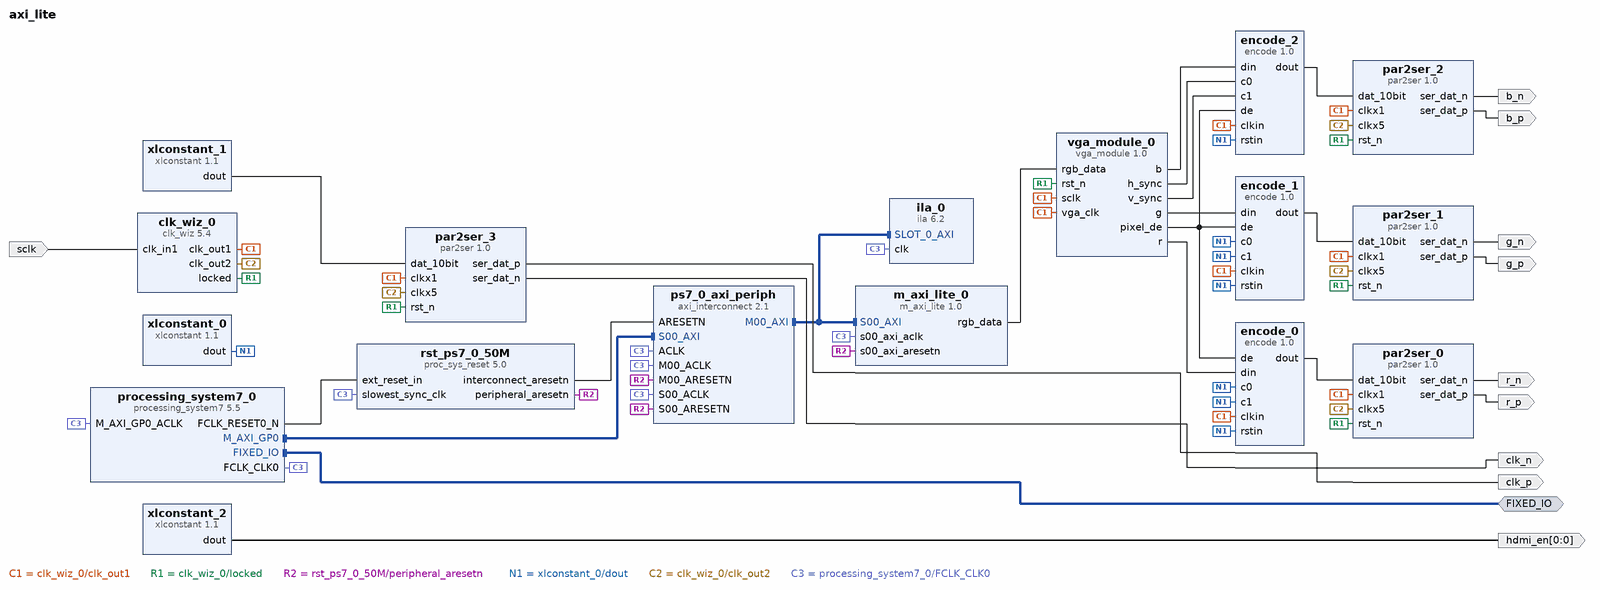
[diagram p0: block diagram of the top level]
# Vivado block design axi_lite, xc7z020clg400-2, Vivado 2017.4
create_bd_design axi_lite

create_bd_intf_port -mode Master -vlnv xilinx.com:display_processing_system7:fixedio_rtl:1.0 FIXED_IO
create_bd_port -dir O r_p
create_bd_port -dir O r_n
create_bd_port -dir O g_p
create_bd_port -dir O g_n
create_bd_port -dir O b_p
create_bd_port -dir O b_n
create_bd_port -dir O clk_p
create_bd_port -dir O clk_n
create_bd_port -dir O -from 0 -to 0 hdmi_en
create_bd_port -dir I -type clk sclk
set_property -dict {CONFIG.FREQ_HZ 50000000} [get_bd_ports sclk]

create_bd_cell -type ip -vlnv xilinx.com:ip:processing_system7:5.5 processing_system7_0
set_property -dict [list \
  CONFIG.PCW_FCLK_CLK0_BUF FALSE \
  CONFIG.PCW_UART_PERIPHERAL_FREQMHZ 100 \
  CONFIG.PCW_UIPARAM_DDR_ENABLE 0 \
  CONFIG.PCW_ENET0_PERIPHERAL_ENABLE 0 \
  CONFIG.PCW_UART0_PERIPHERAL_ENABLE 1 \
  CONFIG.PCW_UART0_UART0_IO {MIO 46 .. 47} \
] [get_bd_cells processing_system7_0]
# 51 more settings of processing_system7_0 are not shown: defaults, MIO pin electricals, DDR timing, and values the tool derives
create_bd_cell -type ip -vlnv xilinx.com:user:vga_module:1.0 vga_module_0
create_bd_cell -type ip -vlnv xilinx.com:user:par2ser:1.0 par2ser_0
create_bd_cell -type ip -vlnv xilinx.com:user:par2ser:1.0 par2ser_1
create_bd_cell -type ip -vlnv xilinx.com:user:par2ser:1.0 par2ser_2
create_bd_cell -type ip -vlnv xilinx.com:user:par2ser:1.0 par2ser_3
create_bd_cell -type ip -vlnv xilinx.com:user:encode:1.0 encode_0
create_bd_cell -type ip -vlnv xilinx.com:user:encode:1.0 encode_1
create_bd_cell -type ip -vlnv xilinx.com:user:encode:1.0 encode_2
create_bd_cell -type ip -vlnv xilinx.com:ip:clk_wiz:5.4 clk_wiz_0
set_property -dict [list \
  CONFIG.PRIM_IN_FREQ 50.000 \
  CONFIG.CLKIN1_JITTER_PS 200.0 \
  CONFIG.CLKOUT2_USED true \
  CONFIG.NUM_OUT_CLKS 2 \
  CONFIG.CLKOUT1_REQUESTED_OUT_FREQ 65.000 \
  CONFIG.CLKOUT2_REQUESTED_OUT_FREQ 325.000 \
  CONFIG.USE_RESET false \
  CONFIG.MMCM_DIVCLK_DIVIDE 1 \
  CONFIG.MMCM_CLKFBOUT_MULT_F 19.500 \
  CONFIG.MMCM_CLKIN1_PERIOD 20.000 \
  CONFIG.MMCM_CLKIN2_PERIOD 10.0 \
  CONFIG.MMCM_CLKOUT0_DIVIDE_F 15.000 \
  CONFIG.MMCM_CLKOUT1_DIVIDE 3 \
  CONFIG.CLKOUT1_JITTER 181.851 \
  CONFIG.CLKOUT1_PHASE_ERROR 160.484 \
  CONFIG.CLKOUT2_JITTER 131.539 \
  CONFIG.CLKOUT2_PHASE_ERROR 160.484 \
] [get_bd_cells clk_wiz_0]
create_bd_cell -type ip -vlnv xilinx.com:ip:xlconstant:1.1 xlconstant_0
set_property -dict {CONFIG.CONST_VAL 0} [get_bd_cells xlconstant_0]
create_bd_cell -type ip -vlnv xilinx.com:ip:xlconstant:1.1 xlconstant_1
set_property -dict {CONFIG.CONST_WIDTH 10 CONFIG.CONST_VAL 992} [get_bd_cells xlconstant_1]
create_bd_cell -type ip -vlnv xilinx.com:ip:axi_interconnect:2.1 ps7_0_axi_periph
set_property -dict {CONFIG.NUM_MI 1} [get_bd_cells ps7_0_axi_periph]
create_bd_cell -type ip -vlnv xilinx.com:ip:proc_sys_reset:5.0 rst_ps7_0_50M
create_bd_cell -type ip -vlnv xilinx.com:ip:xlconstant:1.1 xlconstant_2
create_bd_cell -type ip -vlnv xilinx.com:user:m_axi_lite:1.0 m_axi_lite_0
create_bd_cell -type ip -vlnv xilinx.com:ip:ila:6.2 ila_0

# ---- connections ----

connect_bd_intf_net [get_bd_intf_pins processing_system7_0/M_AXI_GP0] [get_bd_intf_pins ps7_0_axi_periph/S00_AXI]
connect_bd_intf_net [get_bd_intf_pins ps7_0_axi_periph/M00_AXI] [get_bd_intf_pins m_axi_lite_0/S00_AXI]
connect_bd_intf_net [get_bd_intf_pins ps7_0_axi_periph/M00_AXI] [get_bd_intf_pins ila_0/SLOT_0_AXI]
connect_bd_intf_net [get_bd_intf_ports FIXED_IO] [get_bd_intf_pins processing_system7_0/FIXED_IO]
connect_bd_net [get_bd_pins clk_wiz_0/clk_out1] \
  [get_bd_pins vga_module_0/sclk] [get_bd_pins vga_module_0/vga_clk] [get_bd_pins encode_2/clkin] \
  [get_bd_pins encode_1/clkin] [get_bd_pins encode_0/clkin] [get_bd_pins par2ser_3/clkx1] [get_bd_pins par2ser_0/clkx1] \
  [get_bd_pins par2ser_1/clkx1] [get_bd_pins par2ser_2/clkx1]
connect_bd_net [get_bd_pins clk_wiz_0/locked] \
  [get_bd_pins vga_module_0/rst_n] [get_bd_pins par2ser_3/rst_n] [get_bd_pins par2ser_2/rst_n] [get_bd_pins par2ser_1/rst_n] \
  [get_bd_pins par2ser_0/rst_n]
connect_bd_net [get_bd_pins processing_system7_0/FCLK_RESET0_N] [get_bd_pins rst_ps7_0_50M/ext_reset_in]
connect_bd_net [get_bd_pins rst_ps7_0_50M/peripheral_aresetn] \
  [get_bd_pins ps7_0_axi_periph/S00_ARESETN] [get_bd_pins ps7_0_axi_periph/M00_ARESETN] \
  [get_bd_pins m_axi_lite_0/s00_axi_aresetn]
connect_bd_net [get_bd_pins rst_ps7_0_50M/interconnect_aresetn] [get_bd_pins ps7_0_axi_periph/ARESETN]
connect_bd_net [get_bd_pins m_axi_lite_0/rgb_data] [get_bd_pins vga_module_0/rgb_data]
connect_bd_net [get_bd_pins xlconstant_0/dout] \
  [get_bd_pins encode_0/rstin] [get_bd_pins encode_1/rstin] [get_bd_pins encode_2/rstin] [get_bd_pins encode_0/c0] \
  [get_bd_pins encode_0/c1] [get_bd_pins encode_1/c0] [get_bd_pins encode_1/c1]
connect_bd_net [get_bd_pins clk_wiz_0/clk_out2] \
  [get_bd_pins par2ser_0/clkx5] [get_bd_pins par2ser_1/clkx5] [get_bd_pins par2ser_2/clkx5] [get_bd_pins par2ser_3/clkx5]
connect_bd_net [get_bd_pins encode_0/dout] [get_bd_pins par2ser_0/dat_10bit]
connect_bd_net [get_bd_pins encode_1/dout] [get_bd_pins par2ser_1/dat_10bit]
connect_bd_net [get_bd_pins encode_2/dout] [get_bd_pins par2ser_2/dat_10bit]
connect_bd_net [get_bd_pins xlconstant_1/dout] [get_bd_pins par2ser_3/dat_10bit]
connect_bd_net [get_bd_pins vga_module_0/g] [get_bd_pins encode_1/din]
connect_bd_net [get_bd_pins vga_module_0/b] [get_bd_pins encode_2/din]
connect_bd_net [get_bd_pins vga_module_0/h_sync] [get_bd_pins encode_2/c0]
connect_bd_net [get_bd_pins vga_module_0/v_sync] [get_bd_pins encode_2/c1]
connect_bd_net [get_bd_pins vga_module_0/pixel_de] [get_bd_pins encode_2/de] [get_bd_pins encode_0/de] [get_bd_pins encode_1/de]
connect_bd_net [get_bd_pins vga_module_0/r] [get_bd_pins encode_0/din]
connect_bd_net [get_bd_pins par2ser_3/ser_dat_p] [get_bd_ports clk_p]
connect_bd_net [get_bd_pins par2ser_3/ser_dat_n] [get_bd_ports clk_n]
connect_bd_net [get_bd_pins par2ser_2/ser_dat_p] [get_bd_ports b_p]
connect_bd_net [get_bd_pins par2ser_2/ser_dat_n] [get_bd_ports b_n]
connect_bd_net [get_bd_pins par2ser_1/ser_dat_p] [get_bd_ports g_p]
connect_bd_net [get_bd_pins par2ser_1/ser_dat_n] [get_bd_ports g_n]
connect_bd_net [get_bd_pins par2ser_0/ser_dat_p] [get_bd_ports r_p]
connect_bd_net [get_bd_pins par2ser_0/ser_dat_n] [get_bd_ports r_n]
connect_bd_net [get_bd_pins xlconstant_2/dout] [get_bd_ports hdmi_en]
connect_bd_net [get_bd_pins processing_system7_0/FCLK_CLK0] \
  [get_bd_pins processing_system7_0/M_AXI_GP0_ACLK] [get_bd_pins ps7_0_axi_periph/S00_ACLK] \
  [get_bd_pins ps7_0_axi_periph/M00_ACLK] [get_bd_pins ps7_0_axi_periph/ACLK] [get_bd_pins rst_ps7_0_50M/slowest_sync_clk] \
  [get_bd_pins m_axi_lite_0/s00_axi_aclk] [get_bd_pins ila_0/clk]
connect_bd_net [get_bd_ports sclk] [get_bd_pins clk_wiz_0/clk_in1]

# ---- address map ----
assign_bd_address -offset 0x43C00000 -range 64K -target_address_space [get_bd_addr_spaces processing_system7_0/Data] [get_bd_addr_segs m_axi_lite_0/S00_AXI/S00_AXI_reg]

validate_bd_design
save_bd_design
